# EAGLE schematic Schematic_L293D (EAGLE 9.7.0)
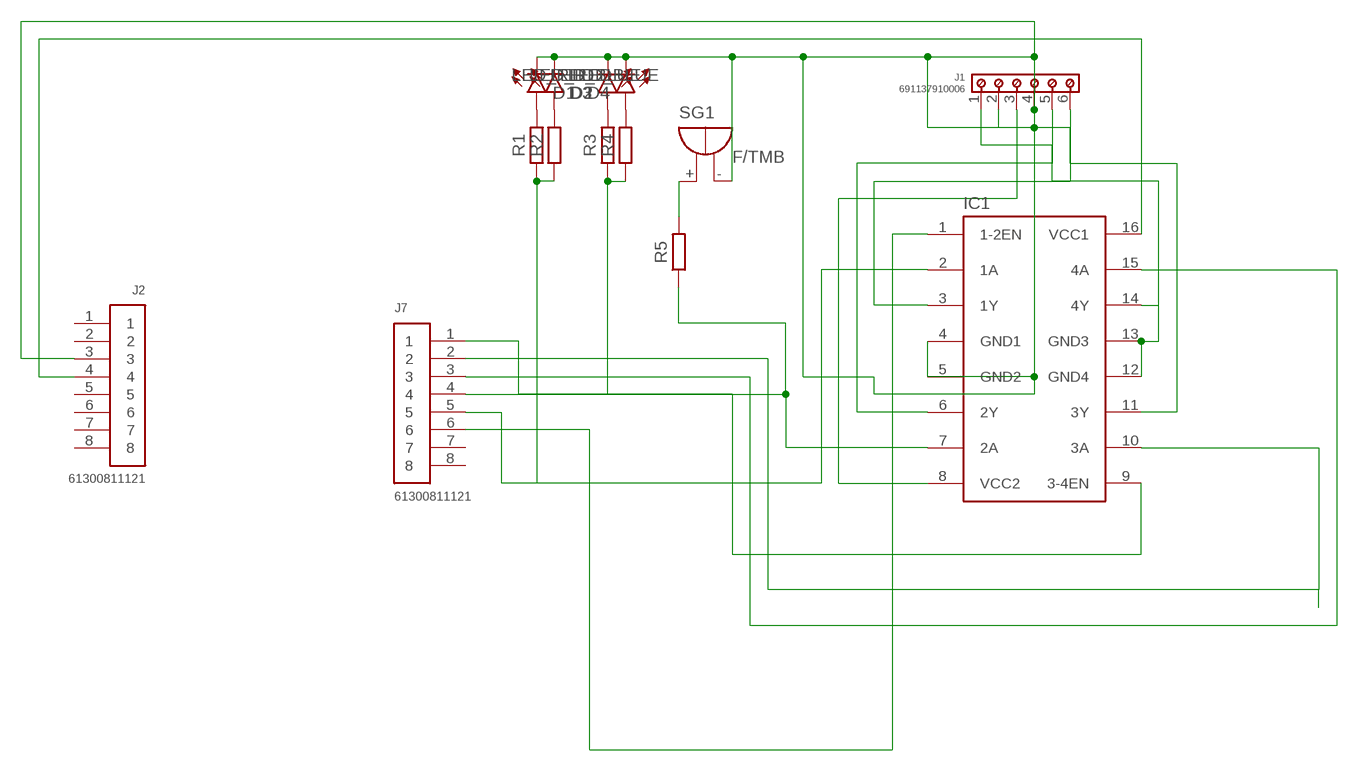
[diagram p0: schematic, sheet 1]

## Parts
D1  LED_BLUE  LED_RADIAL_BLUE  [LEDRD254W60D565H860B_B]
D2  LED_BLUE  LED_RADIAL_BLUE  [LEDRD254W60D565H860B_B]
D3  LED_RED  LED_RADIAL_RED  [LEDRD254W60D565H860B]
D4  LED_RED  LED_RADIAL_RED  [LEDRD254W60D565H860B]
IC1  L293D  [DIL16]
J1  691137910006  [691137910006]
J2  61300811121  [61300811121]
J7  61300811121  [61300811121]
R1  R_AXIAL-11.7MM-PITCH  [RESAD1176W63L850D250B]
R2  R_AXIAL-11.7MM-PITCH  [RESAD1176W63L850D250B]
R3  R_AXIAL-11.7MM-PITCH  [RESAD1176W63L850D250B]
R4  R_AXIAL-11.7MM-PITCH  [RESAD1176W63L850D250B]
R5  R_AXIAL-7.2MM-PITCH  [RESAD724W46L381D178B]
SG1  F/TMB  [F/TMB]

## Nets
N$1: IC1.2(1A) J7.5 R1.1 R2.1
N$2: IC1.3(1Y) J1.6
N$3: IC1.14(4Y) J1.1
N$4: IC1.11(3Y) J1.2
N$5: IC1.16(VCC1) J2.4
N$6: IC1.12(GND4) IC1.13(GND3)
N$8: IC1.6(2Y) J1.5
N$9: D1.1(A) R1.2
N$10: D2.1(A) R2.2
N$11: IC1.15(4A) J7.3
N$12: IC1.10(3A) J7.2
N$13: D3.1(A) R3.2
N$14: D4.1(A) R4.2
N$16: IC1.9(3-4EN) J7.1
N$17: IC1.1(1-2EN) J7.6
N$18: D1.2(C) D2.2(C) D3.2(C) D4.2(C) IC1.4(GND1) IC1.5(GND2) J1.4 J2.3 SG1.-
N$19: IC1.8(VCC2) J1.3
N$20: IC1.7(2A) J7.4 R3.1 R4.1 R5.1
N$21: R5.2 SG1.+
Unconnected: J2.1 J2.2 J2.5 J2.6 J2.7 J2.8 J7.7 J7.8

## Library data of the parts
D1-D4 = Opto-Electronic:LED_RADIAL: LED - Generic; CATEGORY: Opto-Electronic; SUB-CATEGORY: LED
IC1 = st-microelectronics:L293D: PUSH-PULL 4 CHANNEL DRIVER; MPN: L293D; OC_FARNELL: 9589619; OC_NEWARK: 56P8249
J1 = Wurth_Connectors_WR-TBL Wire Protector:691137910006: WR-TBL Serie 1379 - 7.50 mm Horizontal Cable Entry w. Pressure Clamp KIND PROPERTIES Pitch 7.5 mm MATERIAL PROPERTIES Insulator Material PA6/66 Insulator Flammability Rating UL94 V-0 Insulator Color Green Contact Material Copper Alloy Contact Plating Nickel over Tin Contact Type Stamped Terminal Screw Material Steel Terminal Screw Plating Zinc Wire Guard Material Copper Alloy GENERAL INFORMATION Operating Temperature -30 up to +120 °C Compliance Lead free / RoHS ELECTRICAL PROPERTIES IR UL 16 A IR VDE 24 A Working Voltage [UL] 300 V (AC) Working Voltage [VDE] 750 V (AC) Withstanding Voltage [UL] 1600 V (AC) Withstanding Voltage [cULus] 3000 V (AC) Withstanding Voltage [VDE] 3000 V (AC) Contact Resistance 20 mΩ Contact Resistance [UL] 20 mΩ Contact Resistance [VDE] 20 mΩ MECHANICAL PROPERTIES Wire Strip Length 6 (mm) Screw M2.5 Solid Wire Section (AWG) 30 to 12 (AWG) Solid Wire Section (Metric) 0.05 to 3.31 (mm²) Stranded Wire Section (AWG) 30 to 12 (AWG) Stranded Wire Section (Metric) 0.05 to 3.31 (mm²) CERTIFICATION UL Approval E150931 CAT N: MRT12 (7) VDE Approval 40021397 VDE Approval 40021397 TYPE: MRT12 PACKAGING PROPERTIES Packaging Box <https://katalog.we-online.com/media/images/v2/o32803v209%20Family_WR-TBL1_Series1379.jpg> Details see: https://katalog.we-online.com/en/em/TBL_7_50_1379_HORIZONTAL_ENTRY_W_PRESSURE_CLAMP_69113791000x Updated by Ella Wu 2019-11-11 2019(C) Wurth Elektronik; DATASHEET-URL: https://www.we-online.com/catalog/datasheet/691137910006.pdf; IR-UL: 16A; IR-VDE: 24A; MOUNT: THT; PART-NUMBER: 691137910006; PINS: 6; PITCH: 7.5mm; TYPE: Horizontal; WIRE: 30 to 12 (AWG) 0.05 to 3.31 (mm²); WORKING-VOLTAGE-UL: 300V(AC); WORKING-VOLTAGE-VDE: 750V(AC)
J2 J7 = Headers:61300811121: CONN HEADER VERT 8POS 2.54MM Manufacturer's datasheet <https://katalog.we-online.de/em/datasheet/6130xx11121.pdf>; CREATED_BY: PCBLayout.com; DIGI_KEY_PART_NUMBER: 732-5321-ND; MANUFACTURER: Wurth Electronics Inc.; MPN: 61300811121
R1-R5 = Resistor:R: Resistor Fixed - Generic; CATEGORY: Resistor; SUB-CATEGORY: Fixed
SG1 = buzzer:F/TMB: BUZZER Source: Buerklin; OC_FARNELL: unknown; OC_NEWARK: unknown